# Altium schematic sheet aux_power.SchDoc
size A; Engineer: Hoang Pham; SheetNumber: 4; SheetTotal: 4
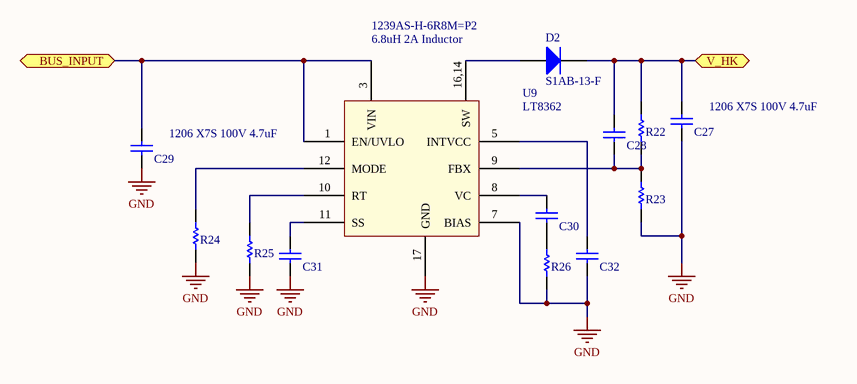
[diagram p0: aux_power.SchDoc]

## Parts
C27  CAP 1nF 100V 1206(3216)  [CAPC1206(3216)100_N]  (value not drawn)
C28  CAP 4.7pF 100V 0603(1608)  [CAPC0603(1608)100_L]  (value not drawn)
C29  CAP 1nF 100V 1206(3216)  [CAPC1206(3216)100_N]  (value not drawn)
C30  CAP 150pF 16V 0402(1005)  [CAPC0402(1005)60_N]  (value not drawn)
C31  CAP 2.2nF 10V 0402(1005)  [CAPC0402(1005)60_M]  (value not drawn)
C32  CAP 1uF 50V 0603(1608)  [CAPC0603(1608)100_N]  (value not drawn)
D2  S1AB-13-F  [DIOD-S1AB-13-F-2_V]
R22  750K 1% 0603(1608)  [RESC0603(1608)_M]  (value not drawn)
R23  34K8 1% 0402(1005)  [RESC0402(1005)_M]  (value not drawn)
R24  Jumper 0402(1005)  [RESC0402(1005)_N]  (value not drawn)
R25  20K 1% 0402(1005)  [RESC0402(1005)_M]  (value not drawn)
R26  57K6 1% 0402(1005)  [RESC0402(1005)_L]  (value not drawn)
U9  LT8362

## Ports
BUS_INPUT, V_HK

## Nets
GND: C27.1 C29.1 C31.1 C32.1 R23.1 R24.1 R25.1 R26.1 U9.7(BIAS) U9.17(GND)
BUS_INPUT: C29.2 U9.1(EN/UVLO) U9.3(VIN) ; port BUS_INPUT
V_HK: C27.2 C28.2 D2.1(K) R22.2 ; port V_HK
NetC28_1: C28.1 R22.1 R23.2 U9.9(FBX)
NetC30_1: C30.1 R26.2
NetC30_2: C30.2 U9.8(VC)
NetC31_2: C31.2 U9.11(SS)
NetC32_2: C32.2 U9.5(INTVCC)
NetD2_2: D2.2(A) U9.16,14(SW)
NetR24_2: R24.2 U9.12(MODE)
NetR25_2: R25.2 U9.10(RT)

## Notes on the sheet
- 1239AS-H-6R8M=P2
- 6.8uH 2A Inductor
- (near C29) 1206 X7S 100V 4.7uF
- (near C27) 1206 X7S 100V 4.7uF

## Library data of the parts
C27 C29 = CMP-1037-02465-1: CAP 1nF 100V ±20% 1206 (3216 Metric) Thickness 1mm SMD; Tolerance: Â±20%; Case-EIA: 1206; Case-Metric: 3216; Technology: SMT; Max Thickness: 1 mm; Rated Voltage: 100 V; Value: 1nF
C28 = CMP-1035-00338-1: CAP 4.7pF 100V ±10% 0603 (1608 Metric) Thickness 1mm SMD; Case-EIA: 0603; Case-Metric: 1608; Tolerance: Â±10%; Technology: SMT; Value: 4.7pF; Max Thickness: 1 mm; Rated Voltage: 100 V
C30 = CMP-1034-01297-1: CAP 150pF 16V ±10% 0402 (1005 Metric) Thickness 0.6mm SMD; Tolerance: Â±10%; Case-Metric: 1005; Case-EIA: 0402; Technology: SMT; Value: 150pF; Rated Voltage: 16 V; Max Thickness: 0.6 mm
C31 = CMP-1034-01728-1: CAP 2.2nF 10V ±10% 0402 (1005 Metric) Thickness 0.6mm SMD; Case-EIA: 0402; Tolerance: Â±10%; Case-Metric: 1005; Max Thickness: 0.6 mm; Technology: SMT; Value: 2.2nF; Rated Voltage: 10 V
C32 = CMP-1035-02746-1: CAP 1uF 50V ±20% 0603 (1608 Metric) Thickness 1mm SMD; Tolerance: Â±20%; Case-EIA: 0603; Case-Metric: 1608; Value: 1uF; Technology: SMT; Max Thickness: 1 mm; Rated Voltage: 50 V
D2 = CMP-0586-00001-2: 1.0 A Surface Mount Glass Passivated Rectifier, SMB, -65 to 150 degC, Tape and Reel; Manufacturer: Diodes Inc; Reverse Recovery Time (Type): 1.8 us; Typical Thermal Resistance, Junction to Terminal: 30 degC/W; Forward Voltage (Max): 1.1 V; Typical Total Capacitance (Type): 10 pF; PackageDescription: 2-Pin SMD, Body 3.62 x 4.315 mm; Mounting Technology: Surface Mount; ComponentLink2URL: http://www.diodes.com/datasheets/ds16003.pdf; DatasheetVersion: Rev. 22-2; PackageReference: S1AB-13-F; ComponentLink3URL: http://www.diodes.com/datasheets/ds16003.pdf; ComponentLink3Description: Package Specification; RoHS Compliance: TRUE; Packing: Tape and Reel; ComponentLink1Description: Manufacturer URL; ComponentLink2Description: Datasheet; Operating and Storage Temperature Range: -65 to 150 degC; ComponentLink1URL: http://www.diodes.com/; PartNumber: S1AB-13-F
R22 = CMP-1012-00835-1: 750K 0.1W 1% 0603 (1608 Metric)  SMD; Case-Metric: 1608; Case-EIA: 0603; Value: 750000.00 Ohm; Tolerance: 1 %; Technology: SMT; Power: 0.1 W
R23 = CMP-1011-00683-1: 34K8 0.063W 1% 0402 (1005 Metric)  SMD; Case-Metric: 1005; Case-EIA: 0402; Value: 34800.00 Ohm; Power: 0.063 W; Tolerance: 1 %; Technology: SMT
R24 = CMP-1011-00001-1: Jumper 0402 (1005 Metric); Tolerance: None; Case-Metric: 1005; Case-EIA: 0402; Value: 0.00 Ohm; Power: None; Technology: SMT
R25 = CMP-1011-00655-1: 20K 0.063W 1% 0402 (1005 Metric)  SMD; Value: 20000.00 Ohm; Case-EIA: 0402; Case-Metric: 1005; Technology: SMT; Power: 0.063 W; Tolerance: 1 %
R26 = CMP-1011-00709-1: 57K6 0.063W 1% 0402 (1005 Metric)  SMD; Value: 57600.00 Ohm; Case-EIA: 0402; Case-Metric: 1005; Technology: SMT; Power: 0.063 W; Tolerance: 1 %